# Altium project EDR_MCU_PCB_CH340_v1.PrjPcb
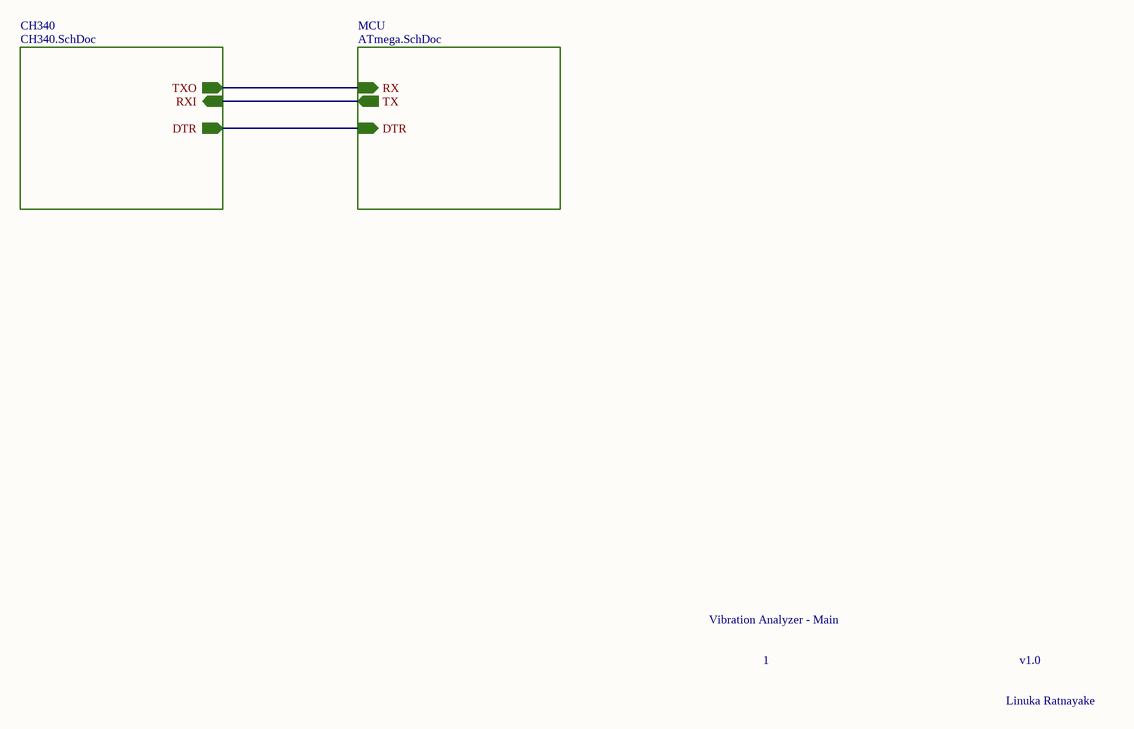
[diagram p0: Main.SchDoc]
3 sheets, 33 parts. Net scope: hierarchical (ports join the sheet entries above them; power ports are global).
Board file: MCU_PCB.PcbDoc
Sheets:
  Main.SchDoc
    MCU = ATmega.SchDoc
    CH340 = CH340.SchDoc

## Sheet Main.SchDoc
size A4; SheetNumber: 1; SheetTotal: 3

### Sub-sheets
CH340 = CH340.SchDoc: TXO (out), RXI (in), DTR (out)
MCU = ATmega.SchDoc: DTR (in), RX (in), TX (out)

### Nets
DTR: sheet MCU/DTR, sheet CH340/DTR
RXI: sheet MCU/TX, sheet CH340/RXI
TXO: sheet MCU/RX, sheet CH340/TXO

### Notes on the sheet
- Vibration Analyzer - Main
- 1
- v1.0
- Linuka Ratnayake

## Sheet ATmega.SchDoc
size A4; SheetNumber: 2; SheetTotal: 3
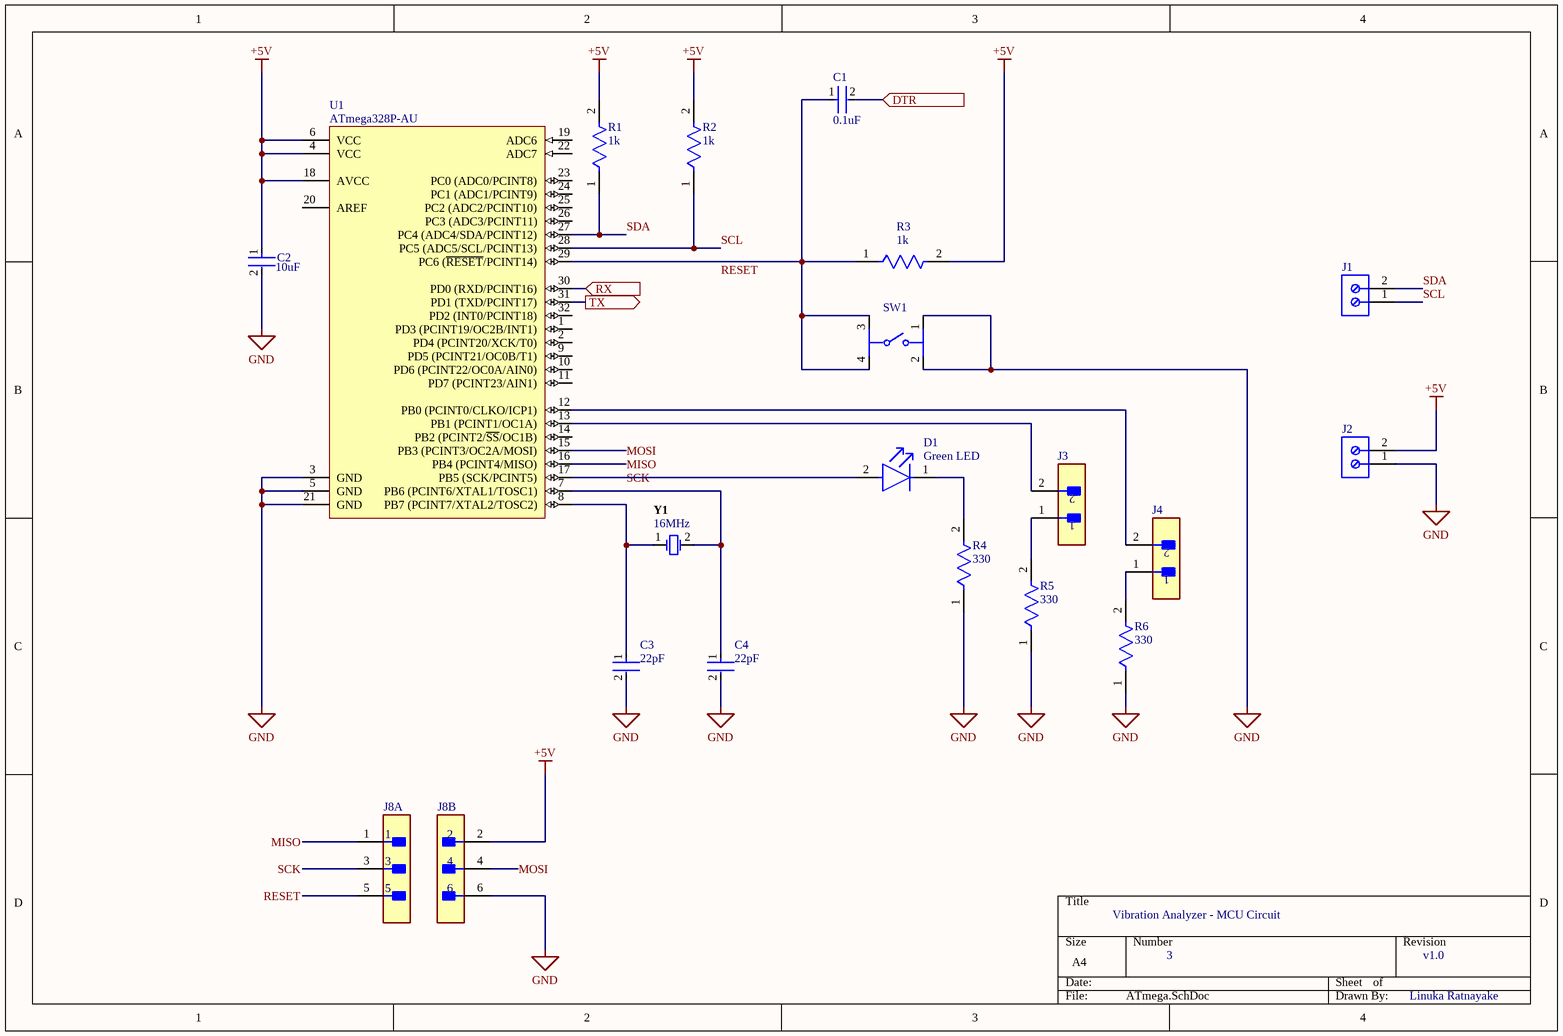
[diagram p1: ATmega.SchDoc]

### Parts
C1  Capacitance: 0.1uF  [FP-GRM31M-0_15-IPC_A]  (hidden comment: GRM31M1X1H104JA01L)
C2  Capacitance: 10uF  [FP-GRM31M-0_15-IPC_A]  (hidden comment: GRM31M1X1H104JA01L)
C3  Capacitance: 22pF  [FP-GRM31M-0_15-IPC_A]  (hidden comment: GRM31M1X1H104JA01L)
C4  Capacitance: 22pF  [FP-GRM31M-0_15-IPC_A]  (hidden comment: GRM31M1X1H104JA01L)
D1  Color: Green LED  [FP-HSMG-C150-MFG]  (hidden comment: HSMG-C150)
J1  691214110002  [691214110002]  (value not drawn)
J2  691214110002  [691214110002]  (value not drawn)
J3  B2B-XH-A(LF)(SN)  [FP-B2B-XH-A_LF_SN-MFG]  (value not drawn)
J4  B2B-XH-A(LF)(SN)  [FP-B2B-XH-A_LF_SN-MFG]  (value not drawn)
J8  M20-9980346  [FP-M20-9980346-MFG]  (value not drawn)  (parts A,B of 2)
R1  Resistance: 1k  [FP-MCR18-IPC_B]  (hidden comment: MCR18EZPF30R0)
R2  Resistance: 1k  [FP-MCR18-IPC_B]  (hidden comment: MCR18EZPF30R0)
R3  Resistance: 1k  [FP-MCR18-IPC_B]  (hidden comment: MCR18EZPF30R0)
R4  Resistance: 330  [FP-MCR18-IPC_B]  (hidden comment: MCR18EZPF30R0)
R5  Resistance: 330  [FP-MCR18-IPC_B]  (hidden comment: MCR18EZPF30R0)
R6  Resistance: 330  [FP-MCR18-IPC_B]  (hidden comment: MCR18EZPF30R0)
SW1  PTS645SM43SMTR92LFS  [FP-PTS645SM43SMTR92LFS-MFG]  (value not drawn)
U1  ATmega328P-AU  [32A_M]
Y1  Frequency: 16MHz  [FOX-FOXSLF160-20]  (hidden comment: FOXSLF/160-20)

### Ports
DTR (in, see Main[2B], CH340[3B]), RX (in, see Main[2B]), TX (out, see Main[2B])

### Nets
+5V: C2.1 J2.2 J8.2 R1.2 R2.2 R3.2 U1.4(VCC) U1.6(VCC) U1.18(AVCC)
GND: C2.2 C3.2 C4.2 J2.1 J8.6 R4.1 R5.1 R6.1 SW1.1 SW1.2 U1.3(GND) U1.5(GND) U1.21(GND)
DTR: C1.2 ; port DTR
MISO: J8.1 U1.16(PB4_(PCINT4/MISO))
MOSI: J8.4 U1.15(PB3_(PCINT3/OC2A/MOSI))
RESET: C1.1 J8.5 R3.1 SW1.3 SW1.4 U1.29(PC6_(~{RESET}/PCINT14))
RXI: U1.31(PD1_(TXD/PCINT17)) ; port TX
SCK: D1.2(A) J8.3 U1.17(PB5_(SCK/PCINT5))
SCL: J1.1 R2.1 U1.28(PC5_(ADC5/SCL/PCINT13))
SDA: J1.2 R1.1 U1.27(PC4_(ADC4/SDA/PCINT12))
TXO: U1.30(PD0_(RXD/PCINT16)) ; port RX
NetC3_1: C3.1 U1.8(PB7_(PCINT7/XTAL2/TOSC2)) Y1.1
NetC4_1: C4.1 U1.7(PB6_(PCINT6/XTAL1/TOSC1)) Y1.2
NetD1_1: D1.1(C) R4.2
NetJ3_1: J3.1 R5.2
NetJ3_2: J3.2 U1.13(PB1_(PCINT1/OC1A))
NetJ4_1: J4.1 R6.2
NetJ4_2: J4.2 U1.12(PB0_(PCINT0/CLKO/ICP1))

Not connected (* = marked no-connect by the designer): U1 1(PD3_(PCINT19/OC2B/INT1)) 2(PD4_(PCINT20/XCK/T0)) 9(PD5_(PCINT21/OC0B/T1)) 10(PD6_(PCINT22/OC0A/AIN0)) 11(PD7_(PCINT23/AIN1)) 14(PB2_(PCINT2/~{SS}/OC1B)) 19(ADC6) 20(AREF) 22(ADC7) 23(PC0_(ADC0/PCINT8)) 24(PC1_(ADC1/PCINT9)) 25(PC2_(ADC2/PCINT10)) 26(PC3_(ADC3/PCINT11)) 32(PD2_(INT0/PCINT18))

### Notes on the sheet
- Vibration Analyzer - MCU Circuit
- 3
- v1.0
- Linuka Ratnayake

### Library data of the parts
C1-C4 = CMP-06035-007547-1: Chip Multilayer Ceramic Capacitors for General Purpose, 1206, 0.10uF, SL, +350/-1000ppm/°C, 5%, 50V; Dissipation Factor: 0.025%; Packaging: Tape and Reel; Length: 0.126inch; Case Code (Imperial): 1206; Voltage Rating (DC): 50V; Max Operating Temperature: 125°C; Voltage: 50V; Height: 1.15mm; Width: 0.063inch; Voltage Rating: 50V; Tolerance: 5%; Min Operating Temperature: -55°C; Mount: Surface Mount; Dielectric Material: Ceramic; Termination: SMD/SMT; Depth: 1.6mm; Case Code (Metric): 3216; Case/Package: 1206; Temperature Coefficient: -1000ppm/°C; Thickness: 0.049inch
D1 = CMP-2000-05061-2: LED GREEN DIFFUSED 1206 SMD; Manufacturer: Broadcom; Led Orientation: Top View; Max Junction Temp: +95°C; Peak Emmision Wavelength: 570nm; Viewing Angle: 170°; Wavelength: 572nm; Reverse Voltage: 5V; Luminous Intensity: 15mcd; Forward Voltage: 2.2V; Power Dissipation: 65mW; Forward Current: 20mA; ComponentLink2Description: Datasheet; Lead Free: Yes; Temperature Range Low: -40°C; Package: HSMG-C150; Digikey Description: LED GREEN DIFFUSED 1206 SMD; Mouser Description: LED Uni-Color Green 570nm 2-Pin Chip LED T/R; Manufacturer Part Number: HSMG-C150; Temperature Range High: +85°C; Device Class L1: Optoelectronics; Colour: Green; Category: Diode; Device Class L3: unset; RoHS: TRUE; Height: 1.2mm; ComponentLink2URL: https://docs.broadcom.com/docs/AV02-0551EN; Device Class L2: LEDs; Automotive: No; Ipc Land Pattern Name: DIOCP320160X55; Octopart: https://octopart.com/hsmg-c150-broadcom-71131304; Temperature: -40°C to +85°C
J1 J2 = CMP-1502-02464-2: NexarPartId: 18818288; Plating: Brass, Steel; Current: 10A; Pitch: 3.5052mm; Number of Levels: 1; Number of Contacts: 2; Wire Gauge (Min): 16AWG; Voltage: 300V; Wire Gauge (Max): 24AWG; Stripping Length: -6mm; Number of Pins: 2; Number of Rows: 1; REACH SVHC: Unknown; RoHS: Compliant; Housing Material: Nylon; Termination: Screw; Mount: Through Hole; Contact Plating: Brass, Tin; Number of Positions Per Level: 2; Color: Blue, Green; Width: 7.9mm; Voltage Rating: 300V; Length: 7.4mm; Current Rating: 10A; Wire/Cable Gauge: 24AWG; Packaging: Box; Max Operating Temperature: 105°C; Lead Pitch: 3.5mm; Height: 8.7mm; Contact Material: Brass; Min Operating Temperature: -40°C
J3 J4 = CMP-2000-05888-3: CONN HEADER VERT 2POS 2.5MM; Current Rating: 3A; Voltage Rating: 250V; Number of Contacts: 2; Contact Resistance: 20mR; Wire/Cable Gauge: 22AWG; Insulation Resistance: 1GR; Connector Type: Male Pin; Packaging: Bulk; Contact Material: Brass; Lead Free: Lead Free; Orientation: Straight; Contact Plating: Tin; Max Current Rating: 3A; Termination: Solder; Fastening Type: Detent; Depth: 5.75mm; Housing Material: Polyamide; REACH SVHC: No SVHC; Series: XH; Voltage Rating (AC): 250V; Number of Positions: 2; Color: Natural; Contact Type: Male Pin; Max Voltage Rating (DC): 250V; Pitch: 2.5mm; Lead Pitch: 2.5mm; Mount: Through Hole; Max Operating Temperature: 85°C; Length: 7.4mm; Max Voltage Rating (AC): 250V; Min Operating Temperature: -25°C; Number of Rows: 1; Housing Color: White
J8 = CMP-2000-06636-2: CONN HEADER VERT 6POS 2.54MM; Manufacturer: Harwin; Current Rating: 3A; Number Of Contacts: 6; Conn Gender: Male; Description: 2.54mm Pitch 6 Way 2 Row Straight PCB Header, Solder Termination, 3A; Conn Orientation: Vertical; Device Class L1: Connectors; ComponentLink2Description: Datasheet; Height: 8.99mm; Temperature Range High: +105°C; Contact Material: Tin,Nickel; RoHS: TRUE; Temperature Range Low: -40°C; ComponentLink2URL: https://cdn.harwin.com/pdfs/M20-998.pdf; Digikey Description: CONN HEADER VERT 6POS 2.54MM; Pitch: 2.54mm; Package: M20-9980346; Device Class L2: Headers and Wire Housings; Manufacturer Part Number: M20-9980346; Number Of Rows: 2; Category: Conn; Lead Free: Yes; Mouser Description: 2.54mm (0.1") Pitch DIL Vertical PC Tail Pin Header, 6.1mm mating pin height, tin, 3+3 contacts; Temperature: -40°C to +105°C; Device Class L3: unset; Octopart: https://octopart.com/m20-9980346-harwin-5436545; Automotive: No
R1-R6 = CMP-08839-012195-1: Thick Film Chip Resistor, 1206, 30Ω, 1%, 100ppm/°C, 0.25W, 200V; Max Power Dissipation: 250mW; Case Code (Imperial): 1206; Case Code (Metric): 3216; Resistor Type: Thick Film; Tolerance: 1%; Package Quantity: 5000; Height: 0.026inch; RoHS Compliant: Yes; Series: MCR18; Number of Terminations: 2; Lead Free: Lead Free; Width: 0.063inch; Length: 0.126inch; Case/Package: 1206; Packaging: Tape and Reel; Features: Automotive AEC-Q200; Voltage Rating (DC): 200V; Temperature Coefficient: 100ppm/°C
SW1 = CMP-2000-05160-2: SWITCH TACTILE SPST-NO 0.05A 12V; Contact Resistance: 100mR; Throw Configuration: SPST; Illumination Type: Non-Illuminated; Mechanical Life: 100000Cycles; Current Rating: 50mA; Switch Function: Off-Mom; Actuator Length: 0.85mm; Actuator Material: Nylon; Actuator Type: Standard; Operating Force: 160gf; Min Operating Temperature: -20°C; REACH SVHC: No SVHC; Termination: Gull Wing; Case/Package: SMD/SMT; Packaging: Tape and Reel; Mount: Surface Mount; Voltage Rating (DC): 12V; Orientation: Straight; Lead Free: Lead Free; Contact Material: Silver; Color: Black; Max Current Rating: 50mA; Contact Plating: Silver; Depth: 9mm; Package Quantity: 1; Max Voltage Rating (DC): 12V; Length: 6mm; Max Operating Temperature: 60°C
U1 = CMP-0095-00269-2: 8-bit AVR Microcontroller, 32KB Flash, 1KB EEPROM, 2KB SRAM, 32-pin TQFP, Industrial Grade (-40°C to 85°C); PackageDescription: 32-Lead, 7x7x1.0 mm Body, 0.8mm Lead Pitch, Thin Profile Plastic Quad Flat Package (TQFP); DatasheetVersion: revD, May-2011; RevisionNote: DatasheetVersion & PackageVersion updated. URLs added.; ComponentLink1URL: http://www.atmel.com/; ComponentLink2Description: ATmega48A/48PA/88A/88PA/168A/168PA/328/328P Datasheet; Code_JEDEC: MS-026-ABA; ComponentLink1Description: Manufacturer URL; PackageReference: 32A; ComponentLink3Description: ATmega48A/48PA/88A/88PA/168A/168PA/328/328P Summary; ComponentLink2URL: http://www.atmel.com/dyn/resources/prod_documents/doc8271.pdf; PackageVersion: revC, Oct-2010; ComponentLink3URL: http://www.atmel.com/dyn/resources/prod_documents/8271S.pdf
Y1 = CMP-1749-00003-1: Resistance Weld Thru-Hole Crystal, 16 MHz, -20 to 70 degC, 2-Pin THD, RoHS, Bulk; Voltage Rating: 250 V; Tolerance: 1%; Resistance: 221 kohm; Case\Package: Axial; Power Rating: 250 mW; RoHSCompliant: true; Package Quantity: 200; Packaging: Bulk; Min Operating Temperature: -55 degC; DatasheetVersion: Mar-15; ComponentLink1URL: http://www.foxonline.com/; Max Operating Temperature: 155 degC; PackageReference: FOXSLF160-20; Mount: Through Hole; PackageDescription: 2-Pin Through Hole Device, Body 11.35 x 4.65 mm; ComponentLink1Description: Manufacturer URL; ComponentLink2URL: http://www.foxonline.com/pdfs/hc49slf.pdf; ComponentLink2Description: Datasheet; Length: 0.248 inch

## Sheet CH340.SchDoc
size A4; SheetNumber: 3; SheetTotal: 3
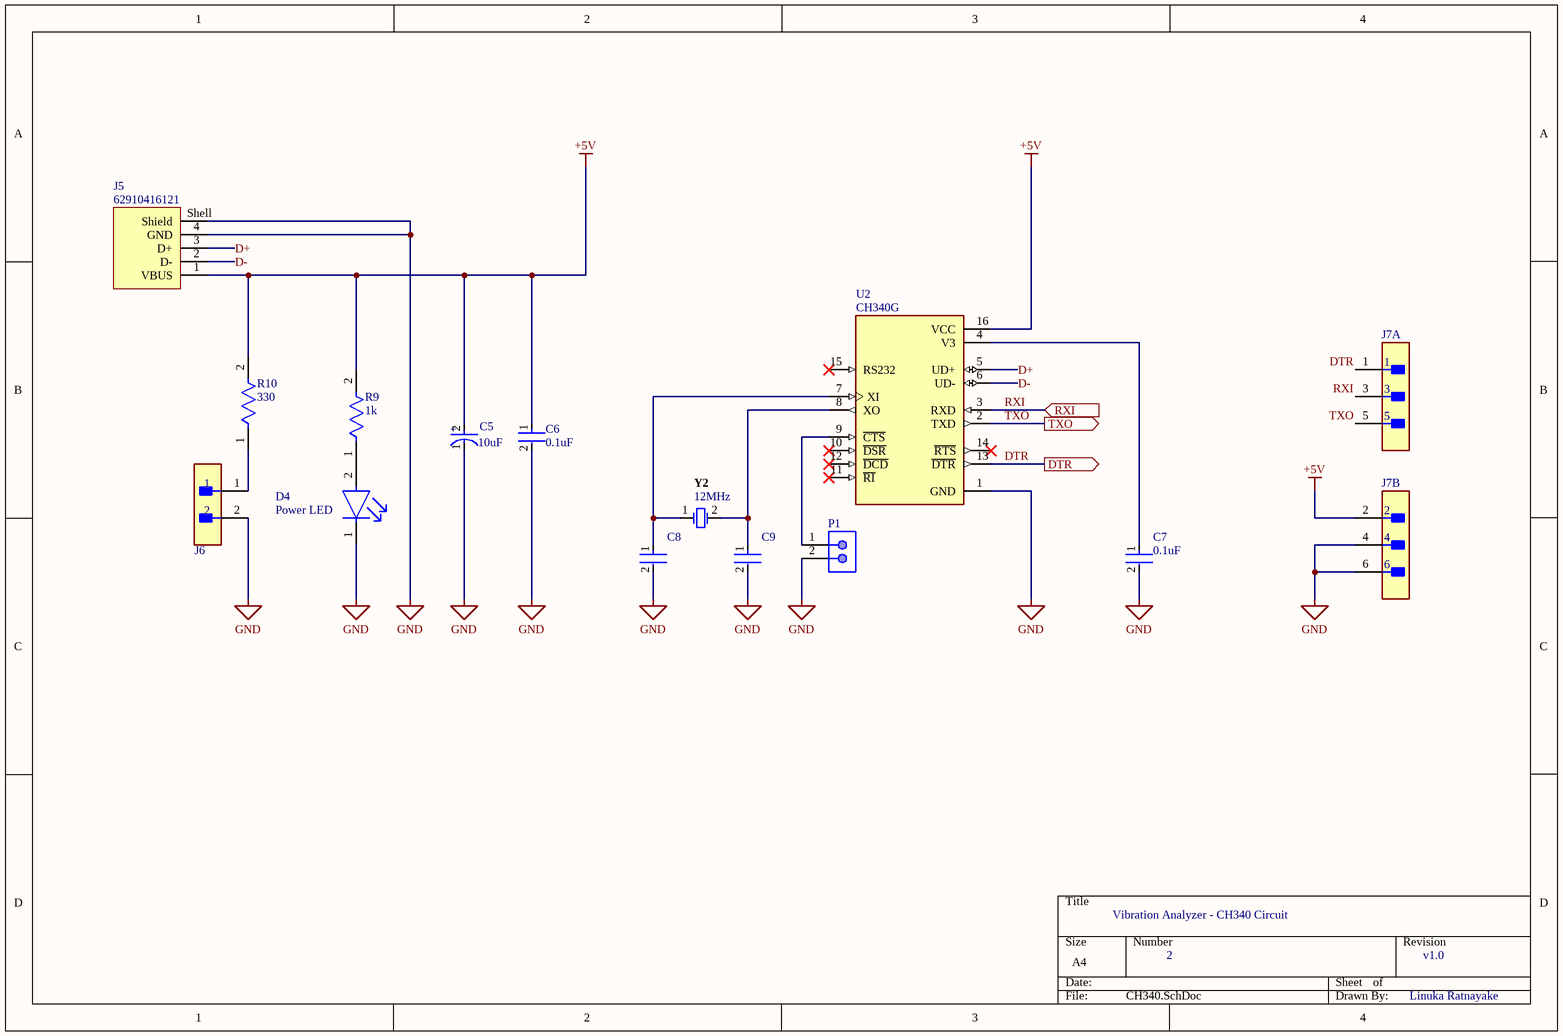
[diagram p2: CH340.SchDoc]

### Parts
C5  Capacitance: 10uF  [FP-SC-MFG]  (hidden comment: EEE1VA100SR)
C6  Capacitance: 0.1uF  [FP-GRM31M-0_15-IPC_A]  (hidden comment: GRM31M1X1H104JA01L)
C7  Capacitance: 0.1uF  [FP-GRM31M-0_15-IPC_A]  (hidden comment: GRM31M1X1H104JA01L)
C8  GRM31M1X1H104JA01L  [FP-GRM31M-0_15-IPC_A]  (value not drawn)
C9  GRM31M1X1H104JA01L  [FP-GRM31M-0_15-IPC_A]  (value not drawn)
D4  Color: Power LED  [FP-HSMG-C150-MFG]  (hidden comment: HSMG-C150)
J5  62910416121  [62910416121]
J6  B2B-XH-A(LF)(SN)  [FP-B2B-XH-A_LF_SN-MFG]  (value not drawn)
J7  M20-9980346  [FP-M20-9980346-MFG]  (value not drawn)  (parts A,B of 2)
P1  22-27-2021  [MOLX-22-27-2021_V]  (value not drawn)
R9  Resistance: 1k  [FP-MCR18-IPC_B]  (hidden comment: MCR18EZPF30R0)
R10  Resistance: 330  [FP-MCR18-IPC_B]  (hidden comment: MCR18EZPF30R0)
U2  CH340G  [SOIC127P600X180-16N]
Y2  value 12MHz  [FOX-FOXSLF-2_V]  (hidden comment: FOXSLF/120-20)

### Ports
DTR (out, see Main[2B], ATmega[3A]), RXI (in, see Main[2B]), TXO (out, see Main[2B])

### Nets
+5V: C5.2(A) C6.1 J5.1(VBUS) J7.2 R9.2 R10.2 U2.16(VCC)
GND: C5.1(C) C6.2 C7.2 C8.2 C9.2 D4.1(C) J5.4(GND) J5.Shell(Shield) J6.2 J7.4 J7.6 P1.2 U2.1(GND)
D+: J5.3(D+) U2.5(UD+)
D-: J5.2(D-) U2.6(UD-)
DTR: J7.1 U2.13(~{DTR}) ; port DTR
RXI: J7.3 U2.3(RXD) ; port RXI
TXO: J7.5 U2.2(TXD) ; port TXO
NetC7_1: C7.1 U2.4(V3)
NetC8_1: C8.1 U2.7(XI) Y2.1
NetC9_1: C9.1 U2.8(XO) Y2.2
NetD4_2: D4.2(A) R9.1
NetJ6_1: J6.1 R10.1
NetP1_1: P1.1 U2.9(~{CTS})

Not connected (* = marked no-connect by the designer): U2 10(~{DSR})* 11(~{RI})* 12(~{DCD})* 14(~{RTS})* 15(RS232)*

### Notes on the sheet
- Vibration Analyzer - CH340 Circuit
- 2
- v1.0
- Linuka Ratnayake
- (in symbol CMP-05427-000087-1) +

### Library data of the parts
C5 = CMP-05427-000087-1: CAP ALUM 10UF 20% 35V SMD; Life (Hours): 2000Hour; Lead Length: 2.2mm; Ripple Current (AC): 30mA; Leakage Current: 3uA; Length: 5.5mm; Construction: Cylindrical; Diameter: 5mm; RoHS Compliant: Yes; REACH SVHC: No SVHC; Max Operating Temperature: 85°C; Series: S; Case/Package: Radial; Contact Plating: Tin; Packaging: Tape and Reel; Voltage Rating: 35V; Number of Pins: 2; Height: 5.4mm; Width: 5.3mm; Voltage Rating (DC): 35V; Mount: Surface Mount; Tolerance: 20%; Lead Pitch: 1.5mm; Radiation Hardening: No; Height - Seated (Max): 0.213inch; Ripple Current: 30mA; Voltage: 35V; Package Quantity: 1; Termination: SMD/SMT; Min Operating Temperature: -40°C
C6 C7 = CMP-06035-007547-1: as C1 on sheet ATmega; Packaging: Tape and Reel; Length: 0.126inch; Case Code (Imperial): 1206; Voltage Rating (DC): 50V; Max Operating Temperature: 125°C; Voltage: 50V; Height: 1.15mm; Width: 0.063inch; Voltage Rating: 50V; Tolerance: 5%; Min Operating Temperature: -55°C; Mount: Surface Mount; Dielectric Material: Ceramic; Termination: SMD/SMT; Depth: 1.6mm; Case Code (Metric): 3216; Case/Package: 1206; Temperature Coefficient: -1000ppm/°C; Thickness: 0.049inch
C8 C9 = CMP-06035-007547-1: Chip Multilayer Ceramic Capacitors for General Purpose, 1206, 0.10uF, SL, +350/-1000ppm/°C, 5%, 50V; Capacitance: 22pF; Dissipation Factor: 0.025%; Packaging: Tape and Reel; Length: 0.126inch; Case Code (Imperial): 1206; Voltage Rating (DC): 50V; Max Operating Temperature: 125°C; Voltage: 50V; Height: 1.15mm; Width: 0.063inch; Voltage Rating: 50V; Tolerance: 5%; Min Operating Temperature: -55°C; Mount: Surface Mount; Dielectric Material: Ceramic; Termination: SMD/SMT; Depth: 1.6mm; Case Code (Metric): 3216; Case/Package: 1206; Temperature Coefficient: -1000ppm/°C; Thickness: 0.049inch
D4 = CMP-2000-05061-2: as D1 on sheet ATmega; ComponentLink2Description: Datasheet; Lead Free: Yes; Temperature Range Low: -40°C; Package: HSMG-C150; Digikey Description: LED GREEN DIFFUSED 1206 SMD; Mouser Description: LED Uni-Color Green 570nm 2-Pin Chip LED T/R; Manufacturer Part Number: HSMG-C150; Temperature Range High: +85°C; Device Class L1: Optoelectronics; Colour: Green; Category: Diode; Device Class L3: unset; RoHS: TRUE; Height: 1.2mm; ComponentLink2URL: https://docs.broadcom.com/docs/AV02-0551EN; Device Class L2: LEDs; Automotive: No; Ipc Land Pattern Name: DIOCP320160X55; Octopart: https://octopart.com/hsmg-c150-broadcom-71131304; Temperature: -40°C to +85°C
J5 = CMP-1502-03244-2: NexarPartId: 19991172; Contact Resistance: 20mΩ; Connector Type: USB; Number of Contacts: 4; Gender: Receptacle; Current Rating: 1.5A; USB Standard: USB 2.0; Operating Supply Voltage: 30V; Insulation Resistance: 1GΩ; Orientation: Horizontal; RoHS: Compliant; Lead Free: Lead Free; Min Operating Temperature: -40°C; Length: 16mm; Number of Pins: 4; Features: Shielded; Contact Plating: Gold; Packaging: Tape and Reel; Max Operating Temperature: 105°C; Termination: SMD/SMT; Mount: Horizontal, Surface Mount; REACH SVHC: Unknown
J6 = CMP-2000-05888-3: as J3 on sheet ATmega; Packaging: Bulk; Contact Material: Brass; Lead Free: Lead Free; Orientation: Straight; Contact Plating: Tin; Max Current Rating: 3A; Termination: Solder; Fastening Type: Detent; Depth: 5.75mm; Housing Material: Polyamide; REACH SVHC: No SVHC; Series: XH; Voltage Rating (AC): 250V; Number of Positions: 2; Color: Natural; Contact Type: Male Pin; Max Voltage Rating (DC): 250V; Pitch: 2.5mm; Lead Pitch: 2.5mm; Mount: Through Hole; Max Operating Temperature: 85°C; Length: 7.4mm; Max Voltage Rating (AC): 250V; Min Operating Temperature: -25°C; Number of Rows: 1; Housing Color: White
J7 = CMP-2000-06636-2: CONN HEADER VERT 6POS 2.54MM; Manufacturer: Harwin; Current Rating: 3A; Number Of Contacts: 6; Conn Gender: Male; Conn Orientation: Vertical; Device Class L1: Connectors; ComponentLink2Description: Datasheet; Height: 8.99mm; Temperature Range High: +105°C; Contact Material: Tin,Nickel; RoHS: TRUE; Temperature Range Low: -40°C; ComponentLink2URL: https://cdn.harwin.com/pdfs/M20-998.pdf; Digikey Description: CONN HEADER VERT 6POS 2.54MM; Pitch: 2.54mm; Package: M20-9980346; Device Class L2: Headers and Wire Housings; Manufacturer Part Number: M20-9980346; Number Of Rows: 2; Category: Conn; Lead Free: Yes; Mouser Description: 2.54mm (0.1") Pitch DIL Vertical PC Tail Pin Header, 6.1mm mating pin height, tin, 3+3 contacts; Temperature: -40°C to +105°C; Device Class L3: unset; Octopart: https://octopart.com/m20-9980346-harwin-5436545; Automotive: No
P1 = CMP-2000-05537-1: Male Header, Pitch 2.54 mm, 1 x 2 Position, Height 11.7 mm, Tail Length 3.56 mm, 0 to 75 degC, RoHS, Bulk; Manufacturer: Molex; PartNumber: 0022272021; Current rating: 4A; Package Version: Rev. BC, 02/2012; Voltage rating: 250V; No. of Positions: 2; Pitch: 2.54mm; No. of Rows: 1; Orientation: Vertical; Operating temperature: 0°Cto+75°C; Manufacturer URL: http://www.molex.com/; Mounting Technology: ThroughHole; Housing material: Nylon(UL94V-0); Package Description: 2-Leads Header, Body 5.08 x 5.8 mm, Pitch 2.54 mm; Voltage - Max: 250V; Datasheet URL: http://www.molex.com/pdm_docs/sd/022272021_sd.pdf; Package Reference: 22-27-2021; Contact material: Tinplatedbrass; Current - Max: 4A; Datasheet Version: Rev. F, 06/2009
R9 R10 = CMP-08839-012195-1: as R1 on sheet ATmega; Case Code (Imperial): 1206; Case Code (Metric): 3216; Resistor Type: Thick Film; Tolerance: 1%; Package Quantity: 5000; Height: 0.026inch; RoHS Compliant: Yes; Series: MCR18; Number of Terminations: 2; Lead Free: Lead Free; Width: 0.063inch; Length: 0.126inch; Case/Package: 1206; Packaging: Tape and Reel; Features: Automotive AEC-Q200; Voltage Rating (DC): 200V; Temperature Coefficient: 100ppm/°C
U2 = CH340G: USB Interface Integrated Circuit; MF: WCH; Value: *; SnapEDA_Link: https://www.snapeda.com/parts/Ch340G/WCH/view-part/?ref=snap; MP: Ch340G; Check_prices: https://www.snapeda.com/parts/Ch340G/WCH/view-part/?ref=eda; Availability: Not in stock; Price: None; Package: None
Y2 = CMP-1749-00004-1: Resistance Weld Thru-Hole Crystal, 12 MHz, +/-30 ppm, -20 to 70 degC, 2-Pin THD, RoHS, Bulk; Elements: 1; Rds On Max: 115 mohm; Typical Rise Time: 90 ns; Max Power Dissipation: 2.5 W; Case\Package: TO-251-3; Input Capacitance: 350 pF; REACH SVHC: No SVHC; Length: 6.6 mm; ComponentLink1URL: http://www.foxonline.com/; PackageDescription: 2-Pin Through Hole Device, Body 11.35 x 4.65 mm, Pitch 4.88 mm; Radiation Hardening: No; Package Quantity: 70; Packaging: Rail/Tube; ComponentLink1Description: Manufacturer URL; Min Operating Temperature: -55 degC; Max Operating Temperature: 150 degC; RoHSCompliant: true; PackageReference: FOXSLF-2; DatasheetVersion: Mar-15; Pins: 3; Height: 6.1 mm; Mount: Through Hole; ComponentLink2URL: http://www.foxonline.com/pdfs/hc49slf.pdf; ComponentLink2Description: Datasheet; Width: 2.3 mm

## Nets that join several sheets
+5V: ATmega (9 pins), CH340 (7 pins)
GND: ATmega (13 pins), CH340 (13 pins)
DTR: ATmega (C1.2), CH340 (J7.1 U2.13)
RXI: ATmega (U1.31), CH340 (J7.3 U2.3)
TXO: ATmega (U1.30), CH340 (J7.5 U2.2)